# Altium schematic sheet SCH-Unified_Sheet_1_Altium.schdoc
size 274 x 183 mm
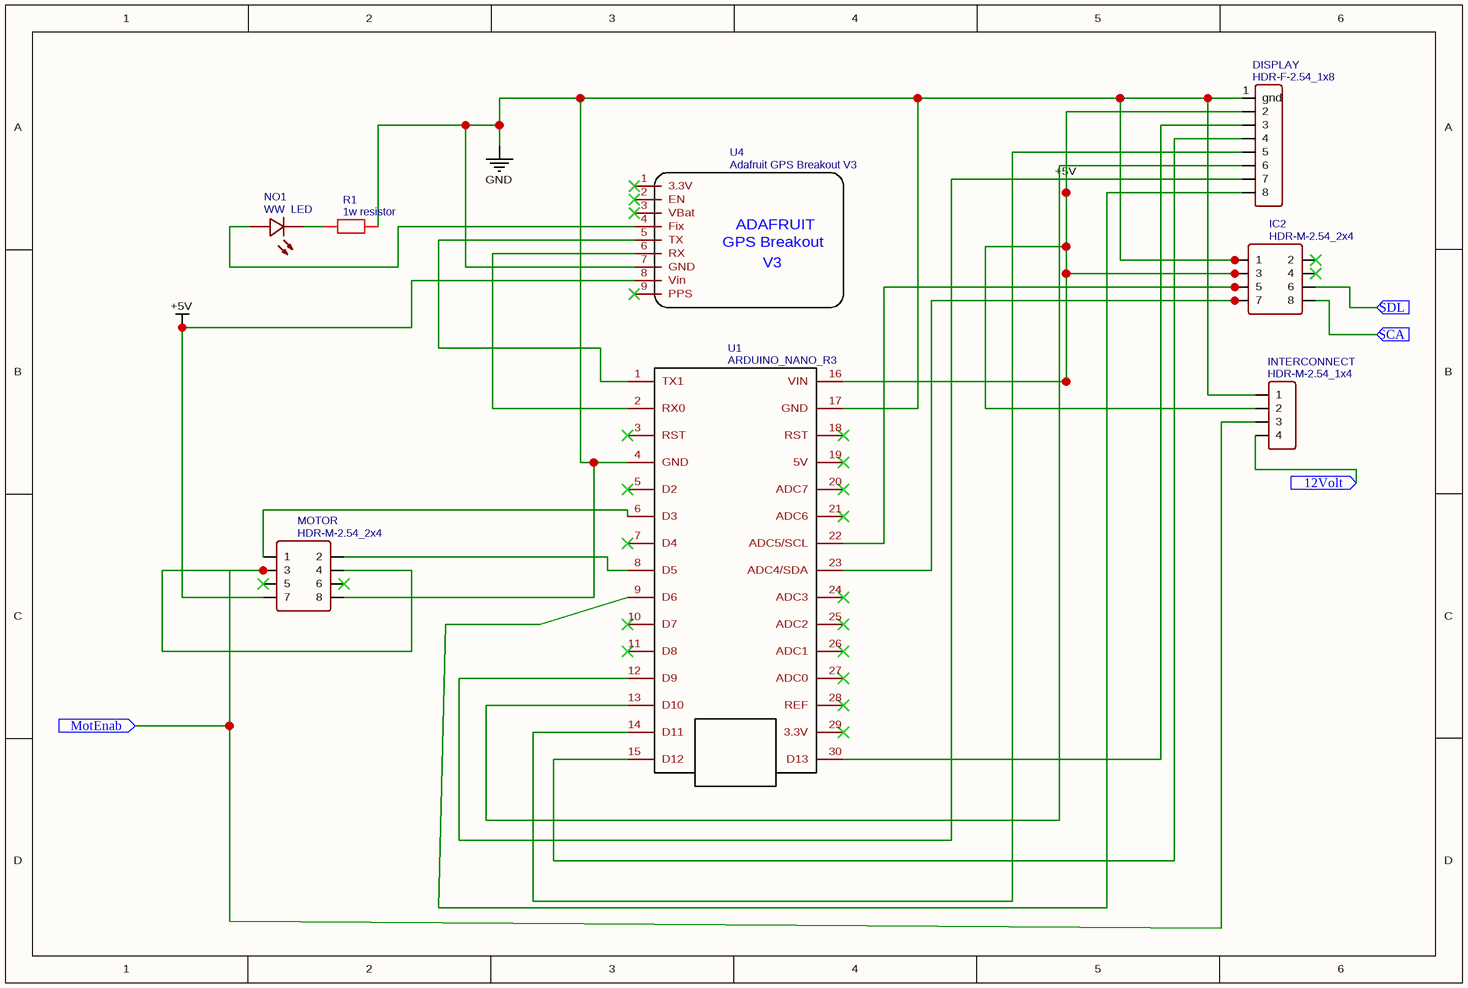
[diagram p0: SCH-Unified_Sheet_1_Altium.schdoc]

## Parts
DISPLAY  HDR-F-2.54_1x8  [HDR-F-2.54_1X8]
IC2  HDR-M-2.54_2x4  [HDR-M-2.54_2X4]
INTERCONNECT  HDR-M-2.54_1x4  [HDR-M-2.54_1X4]
MOTOR  HDR-M-2.54_2x4  [HDR-M-2.54_2X4]
NO1  WW  LED  [LED-TH_LED-3MM_RED]
R1  1w resistor  [2W RESITOR]
U1  ARDUINO_NANO_R3  [ADUINO NANO R3]
U4  Adafruit GPS Breakout V3  [ADAFRUIT GPS BREAKOUT]

## Ports
12Volt (in), MotEnab (in), SCA (in), SDL (in)

## Nets
+5V: DISPLAY.2 IC2.3 INTERCONNECT.2 MOTOR.7 U1.16(VIN) U4.8(Vin)
GND: DISPLAY.1(gnd) IC2.1 INTERCONNECT.1 MOTOR.8 R1.2 U1.4(GND) U1.17(GND) U4.7(GND)
12Volt: INTERCONNECT.4 ; port 12Volt
MotEnab: INTERCONNECT.3 MOTOR.3 MOTOR.4 ; port MotEnab
SCA: IC2.8 ; port SCA
SDL: IC2.6 ; port SDL
NetDISPLAY_3: DISPLAY.3 U1.30(D13)
NetDISPLAY_4: DISPLAY.4 U1.15(D12)
NetDISPLAY_5: DISPLAY.5 U1.14(D11)
NetDISPLAY_6: DISPLAY.6 U1.13(D10)
NetDISPLAY_7: DISPLAY.7 U1.12(D9)
NetDISPLAY_8: DISPLAY.8 U1.9(D6)
NetIC2_5: IC2.5 U1.22(ADC5/SCL)
NetIC2_7: IC2.7 U1.23(ADC4/SDA)
NetMOTOR_1: MOTOR.1 U1.6(D3)
NetMOTOR_2: MOTOR.2 U1.8(D5)
NetNO1_1: NO1.1 U4.4(Fix)
NetNO1_2: NO1.2 R1.1
NetU1_1: U1.1(TX1) U4.5(TX)
NetU1_2: U1.2(RX0) U4.6(RX)

Not connected (* = marked no-connect by the designer): IC2 2* 4*; MOTOR 5* 6*; U1 3(RST)* 5(D2)* 7(D4)* 10(D7)* 11(D8)* 18(RST)* 19(5V)* 20(ADC7)* 21(ADC6)* 24(ADC3)* 25(ADC2)* 26(ADC1)* 27(ADC0)* 28(REF)* 29(3.3V)*; U4 1(3.3V)* 2(EN)* 3(VBat)* 9(PPS)*

## Notes on the sheet
- (in symbol Adafruit GPS Breakout V3) ADAFRUIT; GPS Breakout; V3

## Library data of the parts
DISPLAY = HDR-F-2.54_1x8: Contributor: LCEDA_Lib; Supplier Part: C225505; Supplier: LCSC; spicePre: H; spiceSymbolName: HDR-F-2.54_1x8
IC2 MOTOR = HDR-M-2.54_2x4: Contributor: LCEDA_Lib; Supplier Part: C58363; Supplier: LCSC; spicePre: J; spiceSymbolName: HDR-M-2.54_2x4
INTERCONNECT = HDR-M-2.54_1x4: Contributor: LCEDA_Lib; Supplier Part: C124378; Supplier: LCSC; spicePre: J; spiceSymbolName: HDR-M-2.54_1x4
NO1 = WW  LED: Manufacturer Part: LED-3mm红; Contributor: csnagyt; Supplier: LCSC; Supplier Part: C9900003389; link: https://img.jlc.com/pdf/applyPasteComponent/2021-12-06/748033A/127ffe71aa84443fa05d6ffed81d0b6e/LED-3mm.pdf; JLCPCB Part Class: Extended Part; spicePre: L; spiceSymbolName: LED-3MM红
R1 = 1w resistor: Contributor: Kagutsuchi; spicePre: R; spiceSymbolName: 1w resistor
U1 = ARDUINO_NANO_R3: Contributor: Nikolay Yanev; spicePre: U; spiceSymbolName: ARDUINO_NANO_R3
U4 = Adafruit GPS Breakout V3: Manufacturer Part: New SchematicLib; Contributor: NiklasC; Supplier Part: 746; Supplier: Adafruit; link: https://www.adafruit.com/product/746; spicePre: U; spiceSymbolName: Adafruit GPS Breakout V3